# Altium schematic sheet EXTERNAL_IO.SchDoc: Peripherals
size B; Author: Michael Jones; Engineer: Michael Jones; Organization: Group VIII Technology; Address1: 1652 W 820 N; Address2: Provo; Address3: UT  84601; Address4: 801-379-0118; DocumentNumber: 5; Revision: A3; SheetNumber: 5; SheetTotal: 6
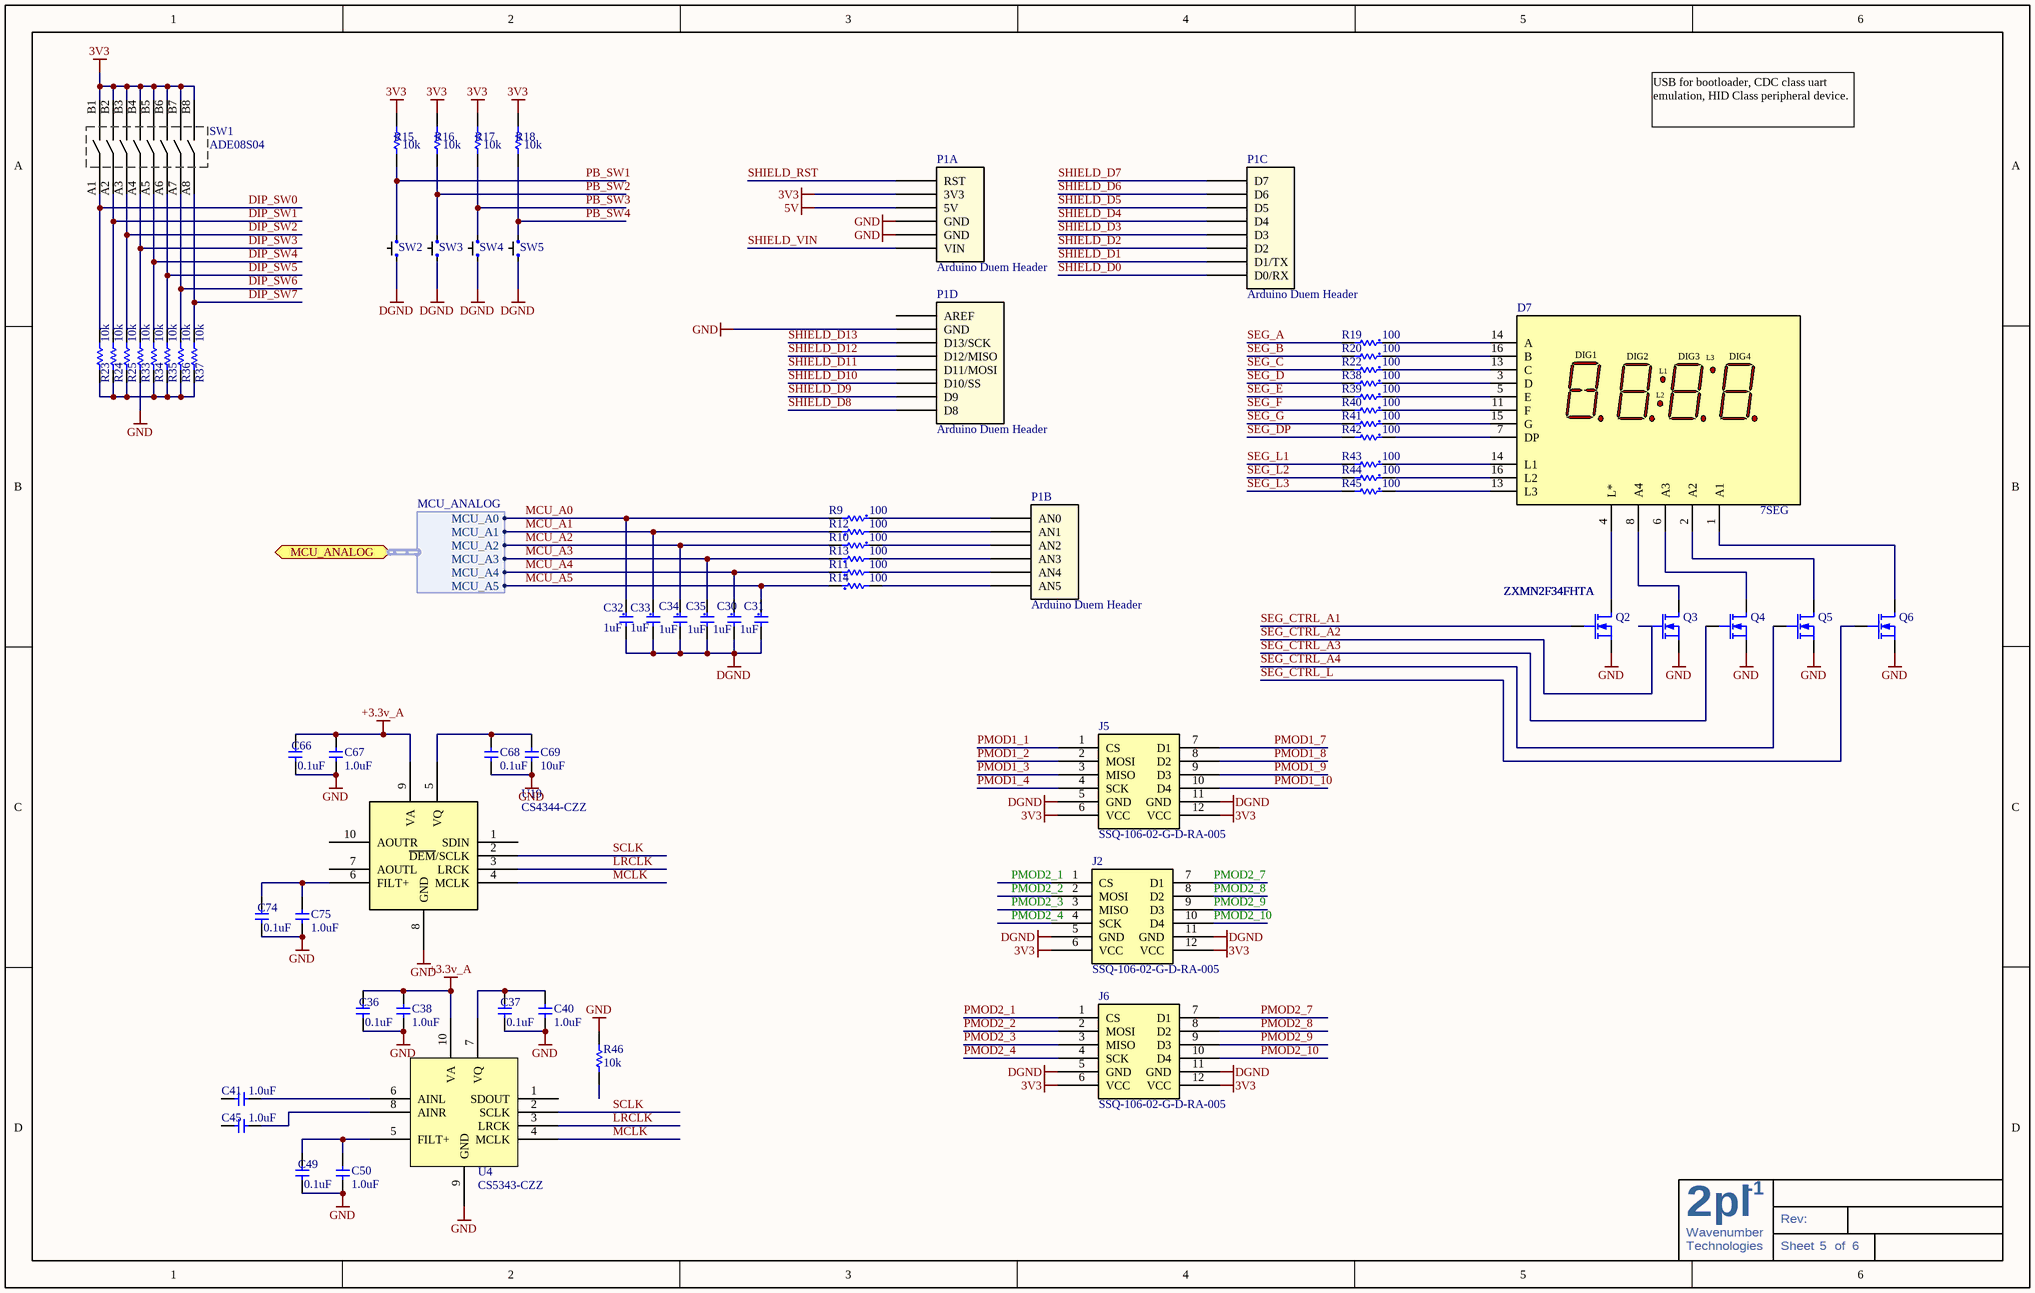
[diagram p0: EXTERNAL_IO.SchDoc]

## Parts
C30  1uF  [C0603]
C31  1uF  [C0603]
C32  1uF  [C0603]
C33  1uF  [C0603]
C34  1uF  [C0603]
C35  1uF  [C0603]
C36  0.1uF  [C0603]
C37  0.1uF  [C0603]
C38  1.0uF  [C0805]
C40  1.0uF  [C0805]
C41  1.0uF  [C0805]
C45  1.0uF  [C0805]
C49  0.1uF  [C0603]
C50  1.0uF  [C0805]
C66  0.1uF  [C0603]
C67  1.0uF  [C0805]
C68  value 0.1uF  [C0603]  (hidden comment: CAP CER .1UF 25V 10% X7R 0603)
C69  10uF  [C1206]
C74  0.1uF  [C0603]
C75  1.0uF  [C0805]
D7  7SEG  [LED - SSEG - LTC-4727JR]
J2  SSQ-106-02-G-D-RA-005  [PMOD Header]
J5  SSQ-106-02-G-D-RA-005  [PMOD Header]
J6  SSQ-106-02-G-D-RA-005  [PMOD Header]
P1  Arduino Duem Header  [Arduino Duem Shield R1]  (parts A,B,C,D of 4)
Q2  ZXMN2F34FHTA  [SOT-23]
Q3  ZXMN2F34FHTA  [SOT-23]
Q4  ZXMN2F34FHTA  [SOT-23]
Q5  ZXMN2F34FHTA  [SOT-23]
Q6  ZXMN2F34FHTA  [SOT-23]
R9  100  [R0603]
R10  100  [R0603]
R11  100  [R0603]
R12  100  [R0603]
R13  100  [R0603]
R14  100  [R0603]
R15  10k  [R0603]
R16  10k  [R0603]
R17  10k  [R0603]
R18  10k  [R0603]
R19  100  [R0603]
R20  100  [R0603]
R22  100  [R0603]
R23  10k  [R0603]
R24  10k  [R0603]
R25  10k  [R0603]
R33  10k  [R0603]
R34  10k  [R0603]
R35  10k  [R0603]
R36  10k  [R0603]
R37  10k  [R0603]
R38  100  [R0603]
R39  100  [R0603]
R40  100  [R0603]
R41  100  [R0603]
R42  100  [R0603]
R43  100  [R0603]
R44  100  [R0603]
R45  100  [R0603]
R46  10k  [R0603]
SW1  ADE08S04  [ADE08S04]
SW2  EVQ-PAG04M  [EVQ-PAG04M]  (value not drawn)
SW3  EVQ-PAG04M  [EVQ-PAG04M]  (value not drawn)
SW4  EVQ-PAG04M  [EVQ-PAG04M]  (value not drawn)
SW5  EVQ-PAG04M  [EVQ-PAG04M]  (value not drawn)
U4  CS5343-CZZ  [TSSOP10]
U19  CS4344-CZZ  [TSSOP10]

## Ports
MCU_ANALOG (harness MCU_ANALOG)

## Harnesses
MCU_ANALOG: MCU_A0, MCU_A1, MCU_A2, MCU_A3, MCU_A4, MCU_A5

## Nets
3V3: J2.6(VCC) J2.12(VCC) J5.6(VCC) J5.12(VCC) J6.6(VCC) J6.12(VCC) P1.A2(3V3) R15.2 R16.2 R17.2 R18.2 SW1.B1 SW1.B2 SW1.B3 SW1.B4 SW1.B5 SW1.B6 SW1.B7 SW1.B8
5V: P1.A3(5V)
+3.3v_A: C36.1 C38.2 C66.1 C67.2 U4.10(VA) U19.9(VA)
DGND: C30.2 C31.2 C32.2 C33.2 C34.2 C35.2 J2.5(GND) J2.11(GND) J5.5(GND) J5.11(GND) J6.5(GND) J6.11(GND) SW2.A SW3.A SW4.A SW5.A
GND: C36.2 C37.2 C38.1 C40.1 C49.2 C50.1 C66.2 C67.1 C68.2 C69.1 C74.2 C75.1 P1.A4(GND) P1.A5(GND) P1.D7(GND) Q2.2 Q3.2 Q4.2 Q5.2 Q6.2 R33.1 R46.2 U4.9(GND) U19.8(GND)
DIP_SW0: R23.2 SW1.A1
DIP_SW1: R24.2 SW1.A2
DIP_SW2: R25.2 SW1.A3
DIP_SW3: R33.2 SW1.A4
DIP_SW4: R34.2 SW1.A5
DIP_SW5: R35.2 SW1.A6
DIP_SW6: R36.2 SW1.A7
DIP_SW7: R37.2 SW1.A8
LRCLK: U4.3(LRCK) U19.3(LRCK)
MCLK: U4.4(MCLK) U19.4(MCLK)
MCU_A0: C32.1 R9.2 ; port MCU_ANALOG.MCU_A0
MCU_A1: C33.1 R12.1 ; port MCU_ANALOG.MCU_A1
MCU_A2: C34.1 R10.2 ; port MCU_ANALOG.MCU_A2
MCU_A3: C35.1 R13.1 ; port MCU_ANALOG.MCU_A3
MCU_A4: C30.1 R11.1 ; port MCU_ANALOG.MCU_A4
MCU_A5: C31.1 R14.1 ; port MCU_ANALOG.MCU_A5
PB_SW1: R15.1 SW2.B
PB_SW2: R16.1 SW3.B
PB_SW3: R17.1 SW4.B
PB_SW4: R18.1 SW5.B
PMOD1_1: J5.1(CS)
PMOD1_2: J5.2(MOSI)
PMOD1_3: J5.3(MISO)
PMOD1_4: J5.4(SCK)
PMOD1_7: J5.7(D1)
PMOD1_8: J5.8(D2)
PMOD1_9: J5.9(D3)
PMOD1_10: J5.10(D4)
PMOD2_1: J2.1(CS) J6.1(CS)
PMOD2_2: J2.2(MOSI) J6.2(MOSI)
PMOD2_3: J2.3(MISO) J6.3(MISO)
PMOD2_4: J2.4(SCK) J6.4(SCK)
PMOD2_7: J2.7(D1) J6.7(D1)
PMOD2_8: J2.8(D2) J6.8(D2)
PMOD2_9: J2.9(D3) J6.9(D3)
PMOD2_10: J2.10(D4) J6.10(D4)
SCLK: U4.2(SCLK) U19.2(~{DEM}/SCLK)
SEG_A: R19.2
SEG_B: R20.2
SEG_C: R22.2
SEG_CTRL_A1: Q2.1(G)
SEG_CTRL_A2: Q3.1(G)
SEG_CTRL_A3: Q4.1(G)
SEG_CTRL_A4: Q5.1(G)
SEG_CTRL_L: Q6.1(G)
SEG_D: R38.2
SEG_DP: R42.2
SEG_E: R39.2
SEG_F: R40.2
SEG_G: R41.2
SEG_L1: R43.2
SEG_L2: R44.2
SEG_L3: R45.2
SHIELD_D0: P1.C1(D0/RX)
SHIELD_D1: P1.C2(D1/TX)
SHIELD_D2: P1.C3(D2)
SHIELD_D3: P1.C4(D3)
SHIELD_D4: P1.C5(D4)
SHIELD_D5: P1.C6(D5)
SHIELD_D6: P1.C7(D6)
SHIELD_D7: P1.C8(D7)
SHIELD_D8: P1.D1(D8)
SHIELD_D9: P1.D2(D9)
SHIELD_D10: P1.D3(D10/SS)
SHIELD_D11: P1.D4(D11/MOSI)
SHIELD_D12: P1.D5(D12/MISO)
SHIELD_D13: P1.D6(D13/SCK)
SHIELD_RST: P1.A1(RST)
SHIELD_VIN: P1.A6(VIN)
NetC37_1: C37.1 C40.2 U4.7(VQ)
NetC41_1: C41.1 U4.6(AINL)
NetC45_1: C45.1 U4.8(AINR)
NetC49_1: C49.1 C50.2 U4.5(FILT+)
NetC68_1: C68.1 C69.2 U19.5(VQ)
NetC74_1: C74.1 C75.2 U19.6(FILT+)
NetD7_1: D7.1(A1) Q6.3(D)
NetD7_2: D7.2(A2) Q5.3(D)
NetD7_3: D7.3(D) R38.1
NetD7_4: D7.4(L*) Q2.3(D)
NetD7_5: D7.5(E) R39.1
NetD7_6: D7.6(A3) Q4.3(D)
NetD7_7: D7.7(DP) R42.1
NetD7_8: D7.8(A4) Q3.3(D)
NetD7_11: D7.11(F) R40.1
NetD7_13: D7.13(C) R22.1
NetD7_13: D7.13(L3) R45.1  [a separate net that carries the same name]
NetD7_14: D7.14(A) R19.1
NetD7_14: D7.14(L1) R43.1  [a separate net that carries the same name]
NetD7_15: D7.15(G) R41.1
NetD7_16: D7.16(B) R20.1
NetD7_16: D7.16(L2) R44.1  [a separate net that carries the same name]
NetP1_B1: P1.B1(AN0) R9.1
NetP1_B2: P1.B2(AN1) R12.2
NetP1_B3: P1.B3(AN2) R10.1
NetP1_B4: P1.B4(AN3) R13.2
NetP1_B5: P1.B5(AN4) R11.2
NetP1_B6: P1.B6(AN5) R14.2
NetR23_1: R23.1 R24.1 R25.1 R34.1 R35.1 R36.1 R37.1

Not connected (* = marked no-connect by the designer): C41 2; C45 2; P1 D8(AREF); R46 1; U4 1(SDOUT); U19 1(SDIN) 7(AOUTL) 10(AOUTR)

## Notes on the sheet
- USB for bootloader, CDC class uart emulation, HID Class peripheral device.
- 2
- Wavenumber
- pl
- -1
- Rev:
- Technologies
- Sheet
- of
- (in symbol LED - SSEG - LTC-4727JR) DIG1; DIG2; DIG3; DIG4

## Library data of the parts
C30-C35 = Cap-Eli: CAP CER .1UF 50V 10% X7R 0603; Manufacturer: Murata Electronics North America; Manufacturer Part Number: GRM188R71H104KA93D; Capacitance: 0.1µF; Value: 1uF; Supplier 1: Digi-Key; Supplier Part Number 1: 490-1519-1-ND; RoHS: RoHS Compliant; Category: Capacitors; Stock 1: 9370695; Pricing 1: 10=0.037, 100=0.0221, 500=0.01276, 1000=0.00884 (USD); Voltage - Rated: 50V; Tolerance: ±10%; Temperature Coefficient: X7R; Mounting Type: Surface Mount, MLCC; Operating Temperature: -55°C ~ 125°C; Features: -; Applications: General Purpose; Ratings: -; Package / Case: 0603 (1608 Metric); Size / Dimension: 0.063" L x 0.031" W (1.60mm x 0.80mm); Lead Spacing: -; Thickness: 0.80mm; Packaging: Cut Tape (CT); Lead Style: -; ComponentLink1URL: http://search.murata.co.jp/Ceramy/image/img/PDF/ENG/GRM188R71H104KA93.pdf; ComponentLink1Description: http://search.murata.co.jp/Ceramy/image/img/PDF/ENG/GRM188R71H104KA93.pdf
C36 C37 C49 C66 C74 = C: CAP CER .1UF 50V 10% X7R 0603; Manufacturer: Murata Electronics North America; Manufacturer Part Number: GRM188R71H104KA93D; Source Part Number: 490-1519-1-ND; Value: 0.1uF 50v; Source: DIGIKEY; ROHS Certificate: ROHS-MURATA-CHIP-CAPS.pdf
C38 C40 C41 C45 C50 C67 C75 = GRM21BR71C105KA01L: CAP CER 1.0UF 16V 10% X7R 0805; Source Part Number: 490-1691-1-ND; Manufacturer: Murata Electronics North America; Source: Digikey; Manufacturer Part Number: GRM21BR71C105KA01L; ROHS Certificate: *; Value: CAP CER 1.0UF 16V 10% X7R 0805
C68 = C: Manufacturer: Murata Electronics North America; Manufacturer Part Number: GRM188R71E104KA01D; Source Part Number: 490-1524-1-ND; Source: DIGIKEY; ROHS Certificate: ROHS-MURATA-CHIP-CAPS.pdf
C69 = GRM31CR71A106KA01L: CAP CER 10UF 10V X7R 1206; Source Part Number: 490-3371-1-ND; Manufacturer: Murata Electronics North America; Source: Digikey; Manufacturer Part Number: GRM31CR71A106KA01L; ROHS Certificate: *; Value: CAP CER 10UF 10V X7R 1206
D7 = LED - SSEG - LTC-4727JR: LED Displays & Accessories 4 Digit, Red Low Current; Manufacturer: Lite-On; Character Size: 10 mm; Display Type: 7 Segment; Operating Voltage: 2 V; Power Consumption: 70 mW; Wavelength: 631 nm; Common Pin: Common Cathode; Luminous Intensity: 975 ucd; Operating Current: 25 mA; Number of Digits: 4; Supplier 1: Mouser; Manufacturer Part Number: LTC-4727JR; RoHS: RoHS Compliant; Category: LED Displays & Accessories; Stock 1: 1398; Pricing 1: 1=2.88, 10=2.74, 50=2.67, 100=2.61, 500=2.31 (AUD); Illumination Color: Red; Packaging: Tube; Maximum Operating Temperature: + 85 C; Minimum Operating Temperature: - 35 C; Product Category: Numeric Display; Standard Pack Qty: 12; RoHS - Mouser: Y; Minimum Order Quantity: 1; Reeling: False; ComponentLink1URL: http://optoelectronics.liteon.com/en-us/product/detail.aspx?txtSpecNo=DS30-2000-193&txtPartNo=LTC-4727JR; ComponentLink1Description: http://optoelectronics.liteon.com/en-us/product/detail.aspx?txtSpecNo=DS30-2000-193&txtPartNo=LTC-4727JR
J2 J5 J6 = P-MOD: SAMTEC - SSQ-106-02-G-D-RA-005 - 2MM SOCKET STRIPS; Supplier 1: Newark; Supplier Part Number 1: 81P8253; Manufacturer: SAMTEC; Manufacturer Part Number: SSQ-106-02-G-D-RA-005; Stock 1: 0; Pricing 1: 1=1.58, 20834=1.4, 41667=1.32 (USD); Value: SSQ-106-02-G-D-RA-005
Q2-Q6 = ZXMN2F34FHTA: MOSFET N-CHAN 20V SOT23-3; Manufacturer: Diodes/Zetex; FET Type: MOSFET N-Channel, Metal Oxide; FET Feature: Logic Level Gate; Rds On (Max) @ Id, Vgs: 60 mOhm @ 2.5A, 4.5V; Current - Continuous Drain (Id) @ 25° C: 3.4A; Vgs(th) (Max) @ Id: 1.5V @ 250µA; Gate Charge (Qg) @ Vgs: 2.8nC @ 4.5V; Input Capacitance (Ciss) @ Vds: 277pF @ 10V; Power - Max: 950mW; Supplier 1: Digi-Key; Manufacturer Part Number: ZXMN2F34FHTA; RoHS: RoHS Compliant; Category: Discrete Semiconductor Products; Stock 1: 24122; Pricing 1: 1=0.55, 10=0.433, 100=0.2964, 250=0.247, 500=0.2052, 1000=0.152 (USD); Drain to Source Voltage (Vdss): 20V; Mounting Type: Surface Mount; Package / Case: SOT-23-3, TO-236-3, Micro3™, SSD3, SST3; Packaging: Cut Tape (CT); Supplier Device Package: *; ComponentLink1URL: http://www.diodes.com/datasheets/ZXMN2F34FH.pdf; ComponentLink1Description: http://www.diodes.com/datasheets/ZXMN2F34FH.pdf; Supplier Part Number 1: ZXMN2F34FHCT-ND; Value: ZXMN2F34FHTA
R9-R14 R19 R20 R22 R38-R45 = Res-Eli: RES 10.0K OHM 1/10W 1% 0603 SMD; Manufacturer: Panasonic - ECG; Manufacturer Part Number: ERJ-3EKF1002V; Power (Watts): 0.1W, 1/10W; Temperature Coefficient: ±100ppm/°C; Value: 100; Supplier 1: Digi-Key; RoHS: RoHS Compliant; Category: Resistors; Stock 1: 11168880; Pricing 1: 1=0.04, 50=0.015, 100=0.0114, 250=0.00844, 500=0.00624, 1000=0.00416 (USD); Resistance (Ohms): 10.0K; Composition: Thick Film; Features: -; Tolerance: ±1%; Size / Dimension: 0.063" L x 0.031" W (1.60mm x 0.80mm); Height: 0.018" (0.45mm); Lead Style: Surface Mount (SMD - SMT); Packaging: Cut Tape (CT); Package / Case: 0603 (1608 Metric); ComponentLink1URL: http://industrial.panasonic.com/www-cgi/jvcr13pz.cgi?E+PZ+3+AOA0002+ERJ3EKF1002V+7+WW; ComponentLink1Description: http://industrial.panasonic.com/www-cgi/jvcr13pz.cgi?E+PZ+3+AOA0002+ERJ3EKF1002V+7+WW; Supplier Part Number 1: P10.0KHCT-ND
R15-R18 R23-R25 R33-R37 = ERJ-3EKF1002V: RES 10.0K OHM 1/10W 1% 0603 SMD; Manufacturer: Panasonic - ECG; Power (Watts): 0.1W, 1/10W; Temperature Coefficient: ±100ppm/°C; Manufacturer Part Number: ERJ-3EKF1002V; Value: 10k; Supplier 1: Digi-Key; RoHS: RoHS Compliant; Category: Resistors; Stock 1: 11168880; Pricing 1: 1=0.04, 50=0.015, 100=0.0114, 250=0.00844, 500=0.00624, 1000=0.00416 (USD); Resistance (Ohms): 10.0K; Composition: Thick Film; Features: -; Tolerance: ±1%; Size / Dimension: 0.063" L x 0.031" W (1.60mm x 0.80mm); Height: 0.018" (0.45mm); Lead Style: Surface Mount (SMD - SMT); Packaging: Cut Tape (CT); Package / Case: 0603 (1608 Metric); ComponentLink1URL: http://industrial.panasonic.com/www-cgi/jvcr13pz.cgi?E+PZ+3+AOA0002+ERJ3EKF1002V+7+WW; ComponentLink1Description: http://industrial.panasonic.com/www-cgi/jvcr13pz.cgi?E+PZ+3+AOA0002+ERJ3EKF1002V+7+WW; Supplier Part Number 1: P10.0KHCT-ND
R46 = ERJ-3EKF1002V: RES 10.0K OHM 1/10W 1% 0603 SMD; Source Part Number: P10.0KHCT-ND; Manufacturer: Panasonic - ECG; Power (Watts): 0.1W, 1/10W; Temperature Coefficient: ±100ppm/°C; Source: Digikey; ROHS Certificate: *; RoHS: RoHS Compliant; Category: Resistors; Resistance In Ohms: 10.0K; Composition: Thick Film; Features: -; Tolerance: ±1%; Case: 0603 (1608 metric); Size / Dimension: 0.063" L x 0.031" W (1.60mm x 0.80mm); Height: 0.018" (0.45mm); Lead Style: Surface Mount (SMD - SMT); Packaging: Cut Tape (CT); ComponentLink1URL: http://industrial.panasonic.com/www-cgi/jvcr13pz.cgi?E+PZ+3+AOA0002+ERJ3EKF1002V+7+WW; ComponentLink1Description: http://industrial.panasonic.com/www-cgi/jvcr13pz.cgi?E+PZ+3+AOA0002+ERJ3EKF1002V+7+WW; Manufacturer Part Number: ERJ-3EKF1002V; Supplier 1: Digi-Key; Stock 1: 10570746; Pricing 1: 1=0.04, 50=0.015, 100=0.0114, 250=0.00844, 500=0.00624, 1000=0.00416 (USD); Supplier Part Number 1: P10.0KHCT-ND; Value: 10k
SW1 = ADE08S04: SWITCH DIP SPST EXT ACT 8POS SMD; Manufacturer: TE Connectivity; Number of Positions: 8; Contact Rating @ Voltage: 0.4VA @ 20VAC/DC; Actuator Type: Standard; Actuator Level: Raised; Washable: Yes; Supplier 1: Digi-Key; Supplier Part Number 1: 1-1825058-9-ND; Manufacturer Part Number: ADE08S04; RoHS: RoHS Compliant; Category: Switches; Stock 1: 28135; Pricing 1: 1=1, 10=0.879, 50=0.7926, 100=0.7581, 250=0.68916, 500=0.62024, 1000=0.55133, 5000=0.48241, 10000=0.45829 (USD); Circuit: SPST; Mounting Type: Surface Mount; Orientation: Top Actuated; ComponentLink1URL: http://documents.tycoelectronics.com/commerce/DocumentDelivery/DDEController?Action=srchrtrv&DocNm=1825058&DocType=CD&DocLang=EN; ComponentLink1Description: http://documents.tycoelectronics.com/commerce/DocumentDelivery/DDEController?Action=srchrtrv&DocNm=1825058&DocType=CD&DocLang=EN; Value: ADE08S04
SW2-SW5 = EVQ-PAG04M: 6MM LIGHT TOUCH SWITCH 250GF; Manufacturer: Panasonic - ECG; Source Part Number: P8009S-ND; Circuit: SPST-NO; Switch Function: Off-Mom; Contact Rating @ Voltage: 0.02A @ 15VDC; Actuator Type: Standard; Outline: 6.00mm x 6.00mm; Illumination: Non-Illuminated; Manufacturer Part Number: EVQ-PAG04M; Source: Digikey; Value: EVQ-PAG04M; Supplier 1: Digi-Key; Supplier Part Number 1: P8009S-ND; RoHS: RoHS Compliant; Category: Switches; Stock 1: 47438; Pricing 1: 1=0.22, 10=0.183, 100=0.1533, 500=0.1314, 1000=0.1095, 5000=0.09709 (USD); Mounting Type: Through Hole; Orientation: Vertical; Operating Force: 250gf; Packaging: Bulk; ComponentLink1URL: http://industrial.panasonic.com/www-data/pdf/ATK0000/ATK0000CE10.pdf; ComponentLink1Description: http://industrial.panasonic.com/www-data/pdf/ATK0000/ATK0000CE10.pdf
U4 = CS5343-CZZ: IC ADC AUD 98DB 108KHZ 10-TSSOP; Manufacturer: rus Logic Inc; Source Part Number: 598-1189-ND; Manufacturer Part Number: CS5343-CZZ; Source: Digikey; Value: CS5343-CZZ
U19 = CS4344-CZZ: IC DAC STER 24BIT 192KHZ 10TSSOP; Manufacturer: rus Logic Inc; Source Part Number: 598-1051-5-ND; Number of Bits: 24; Data Interface: Serial; Number of Converters: 2; Voltage Supply Source: Single Supply; Power Dissipation (Max): 150mW; Manufacturer Part Number: CS4344-CZZ; Source: Digikey; Value: CS4344-CZZ; Supplier 1: Digi-Key; Supplier Part Number 1: 598-1051-5-ND; RoHS: RoHS Compliant; Category: Integrated Circuits (ICs); Stock 1: 1830; Pricing 1: 1=3.02, 25=2.43, 100=2.214, 250=1.998, 500=1.7928, 1000=1.512, 2500=1.4364, 5000=1.377, 10000=1.3392 (USD); Settling Time: -; Operating Temperature: -10°C ~ 70°C; Mounting Type: Surface Mount; Package / Case: 10-TFSOP (0.118", 3.00mm Width); Supplier Device Package: 10-TSSOP; Packaging: Tube; ComponentLink1URL: http://www.cirrus.com/en/pubs/proDatasheet/CS4344-45-46-48_F1.pdf; ComponentLink1Description: http://www.cirrus.com/en/pubs/proDatasheet/CS4344-45-46-48_F1.pdf